# EAGLE design PLT-01-RevD (EAGLE 7.6.0)
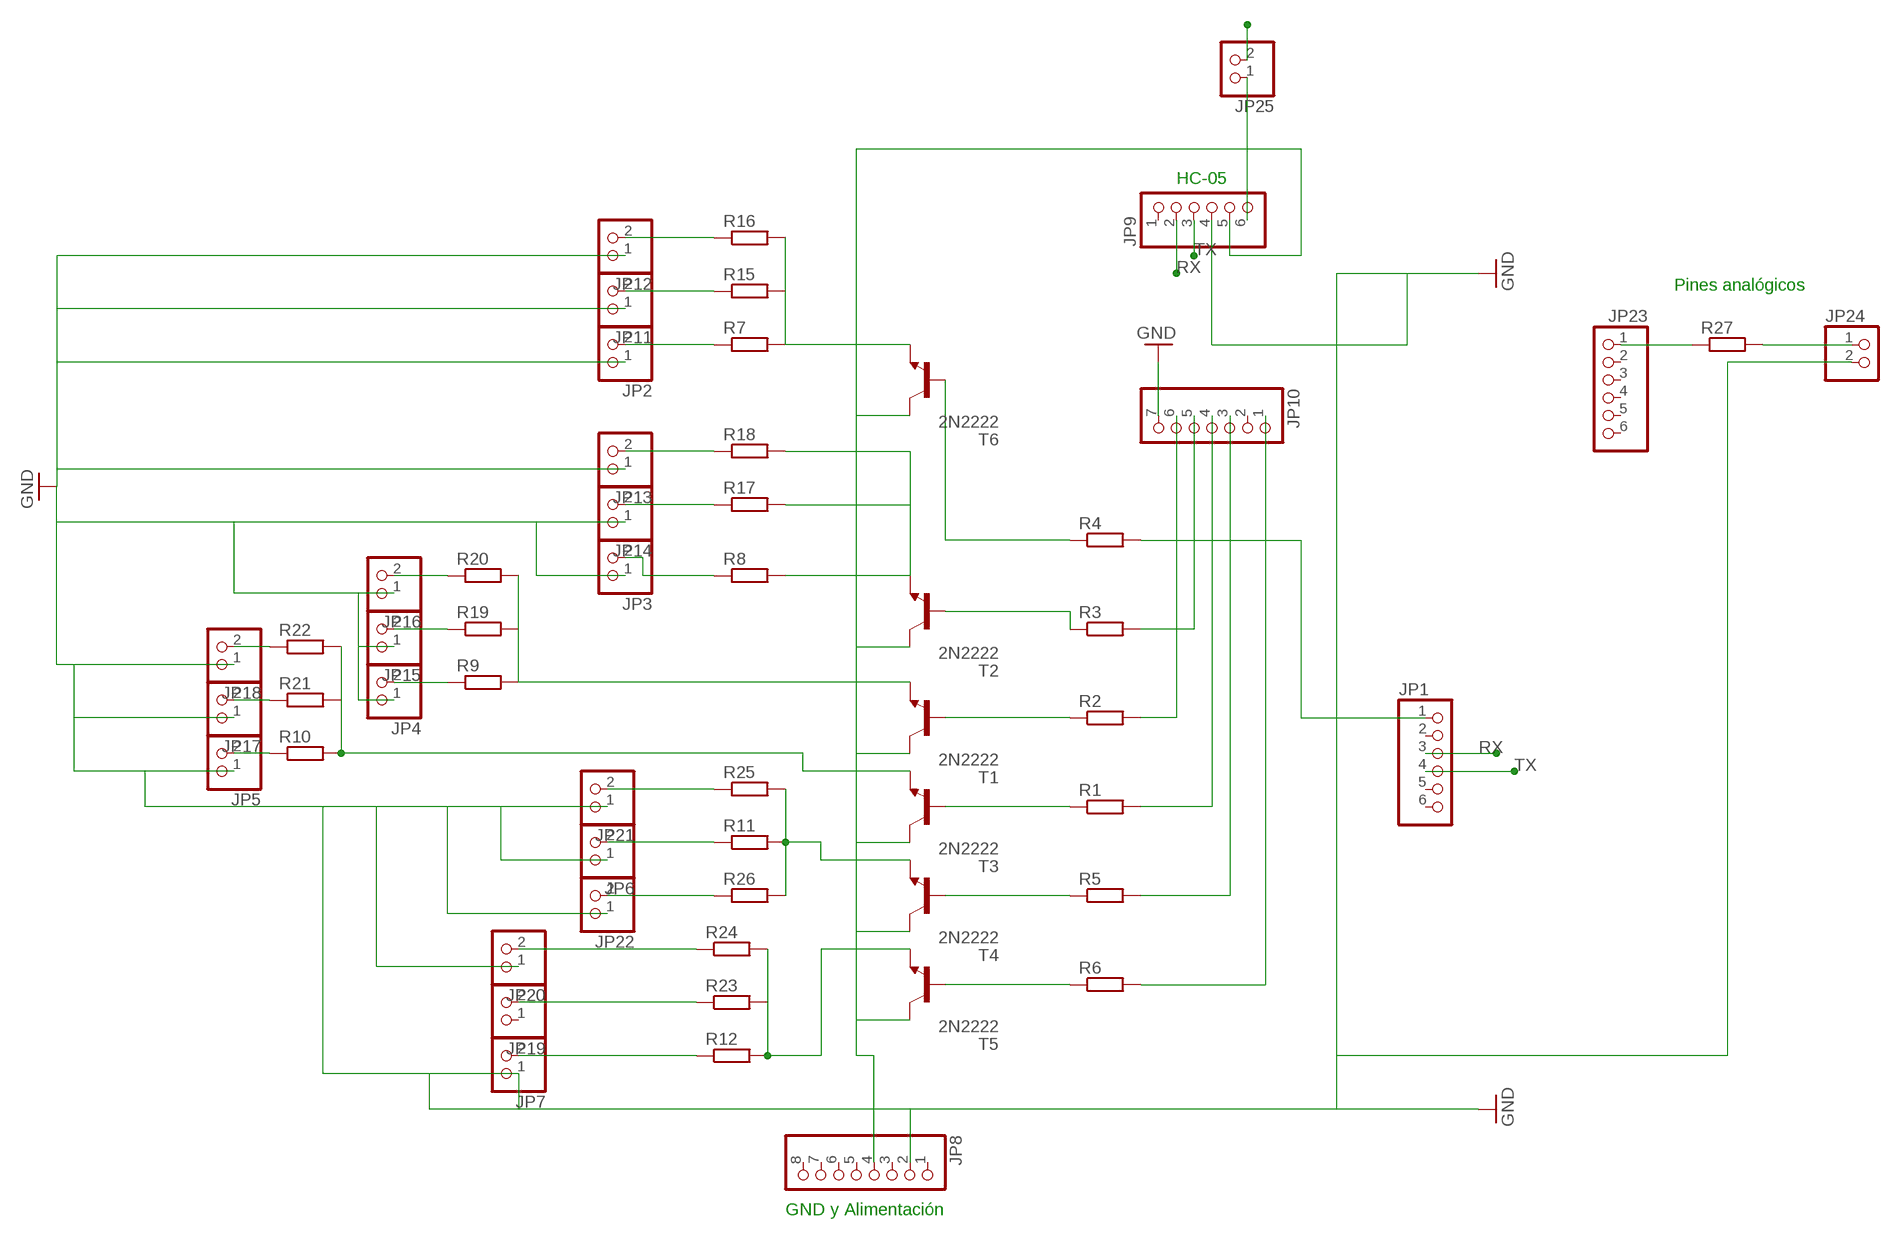
[diagram p0: schematic, sheet 1]

## Parts
JP1  PINHD-1X6  [1X06]
JP2  PINHD-1X2  [1X02]
JP3  PINHD-1X2  [1X02]
JP4  PINHD-1X2  [1X02]
JP5  PINHD-1X2  [1X02]
JP6  PINHD-1X2  [1X02]
JP7  PINHD-1X2  [1X02]
JP8  PINHD-1X8  [1X08]
JP9  PINHD-1X6  [1X06]
JP10  PINHD-1X7  [1X07]
JP11  PINHD-1X2  [1X02]
JP12  PINHD-1X2  [1X02]
JP13  PINHD-1X2  [1X02]
JP14  PINHD-1X2  [1X02]
JP15  PINHD-1X2  [1X02]
JP16  PINHD-1X2  [1X02]
JP17  PINHD-1X2  [1X02]
JP18  PINHD-1X2  [1X02]
JP19  PINHD-1X2  [1X02]
JP20  PINHD-1X2  [1X02]
JP21  PINHD-1X2  [1X02]
JP22  PINHD-1X2  [1X02]
JP23  PINHD-1X6  [1X06]
JP24  PINHD-1X2  [1X02]
JP25  PINHD-1X2  [1X02]
R1  R-EU_0207/10  [0207/10]
R2  R-EU_0207/10  [0207/10]
R3  R-EU_0207/10  [0207/10]
R4  R-EU_0207/10  [0207/10]
R5  R-EU_0207/10  [0207/10]
R6  R-EU_0207/10  [0207/10]
R7  R-EU_0207/10  [0207/10]
R8  R-EU_0207/10  [0207/10]
R9  R-EU_0207/10  [0207/10]
R10  R-EU_0207/10  [0207/10]
R11  R-EU_0207/10  [0207/10]
R12  R-EU_0207/10  [0207/10]
R15  R-EU_0207/10  [0207/10]
R16  R-EU_0207/10  [0207/10]
R17  R-EU_0207/10  [0207/10]
R18  R-EU_0207/10  [0207/10]
R19  R-EU_0207/10  [0207/10]
R20  R-EU_0207/10  [0207/10]
R21  R-EU_0207/10  [0207/10]
R22  R-EU_0207/10  [0207/10]
R23  R-EU_0207/10  [0207/10]
R24  R-EU_0207/10  [0207/10]
R25  R-EU_0207/10  [0207/10]
R26  R-EU_0207/10  [0207/10]
R27  R-EU_0207/10  [0207/10]
T1  2N2222  [TO92-EBC-OVAL]
T2  2N2222  [TO92-EBC-OVAL]
T3  2N2222  [TO92-EBC-OVAL]
T4  2N2222  [TO92-EBC-OVAL]
T5  2N2222  [TO92-EBC-OVAL]
T6  2N2222  [TO92-EBC-OVAL]

## Nets
5V: JP8.4 JP9.5 JP25.2 T1.C T2.C T3.C T4.C T5.C T6.C
GND: JP2.1 JP3.1 JP4.1 JP5.1 JP6.1 JP7.1 JP8.2 JP9.4 JP10.7 JP11.1 JP12.1 JP13.1 JP14.1 JP15.1 JP16.1 JP17.1 JP18.1 JP20.1 JP21.1 JP22.1 JP24.2
N$1: JP1.1 R4.2
N$2: JP10.5 R3.2
N$3: JP10.6 R2.2
N$4: JP10.4 R1.2
N$5: JP10.3 R5.2
N$6: JP9.6 JP25.1
N$7: R6.1 T5.B
N$8: R5.1 T4.B
N$9: R1.1 T3.B
N$10: R2.1 T1.B
N$11: R3.1 T2.B
N$12: R4.1 T6.B
N$13: R7.2 R15.2 R16.2 T6.E
N$14: JP2.2 R7.1
N$15: R8.2 R17.2 R18.2 T2.E
N$16: JP3.2 R8.1
N$17: R9.2 R19.2 R20.2 T1.E
N$18: JP4.2 R9.1
N$19: R10.2 R21.2 R22.2 T3.E
N$20: JP5.2 R10.1
N$21: R11.2 R25.2 R26.2 T4.E
N$22: JP6.2 R11.1
N$23: R12.2 R23.2 R24.2 T5.E
N$24: JP7.2 R12.1
N$29: JP13.2 R18.1
N$30: JP14.2 R17.1
N$31: JP17.2 R21.1
N$32: JP18.2 R22.1
N$33: JP19.2 R23.1
N$34: JP20.2 R24.1
N$35: JP21.2 R25.1
N$36: JP22.2 R26.1
N$37: JP12.2 R16.1
N$38: JP11.2 R15.1
N$39: JP16.2 R20.1
N$40: JP15.2 R19.1
N$41: JP23.1 R27.1
N$42: JP24.1 R27.2
N$44: JP10.1 R6.2
RX: JP1.3 JP9.2
TX: JP1.4 JP9.3
Unconnected: JP1.2 JP1.5 JP1.6 JP8.1 JP8.3 JP8.5 JP8.6 JP8.7 JP8.8 JP9.1 JP10.2 JP19.1 JP23.2 JP23.3 JP23.4 JP23.5 JP23.6

## Notes on the sheet
- HC-05
- Pines analógicos
- GND y Alimentación

## Library data of the parts
JP1 JP9 JP23 = pinhead:PINHD-1X6: PIN HEADER
JP2-JP7 JP11-JP22 JP24 JP25 = pinhead:PINHD-1X2: PIN HEADER
JP8 = pinhead:PINHD-1X8: PIN HEADER
JP10 = pinhead:PINHD-1X7: PIN HEADER
R1-R12 R15-R27 = resistor:R-EU_: RESISTOR, European symbol
T1-T6 = adafruit:2N2222: NPN TRANSISTOR Big oval pads

## Board
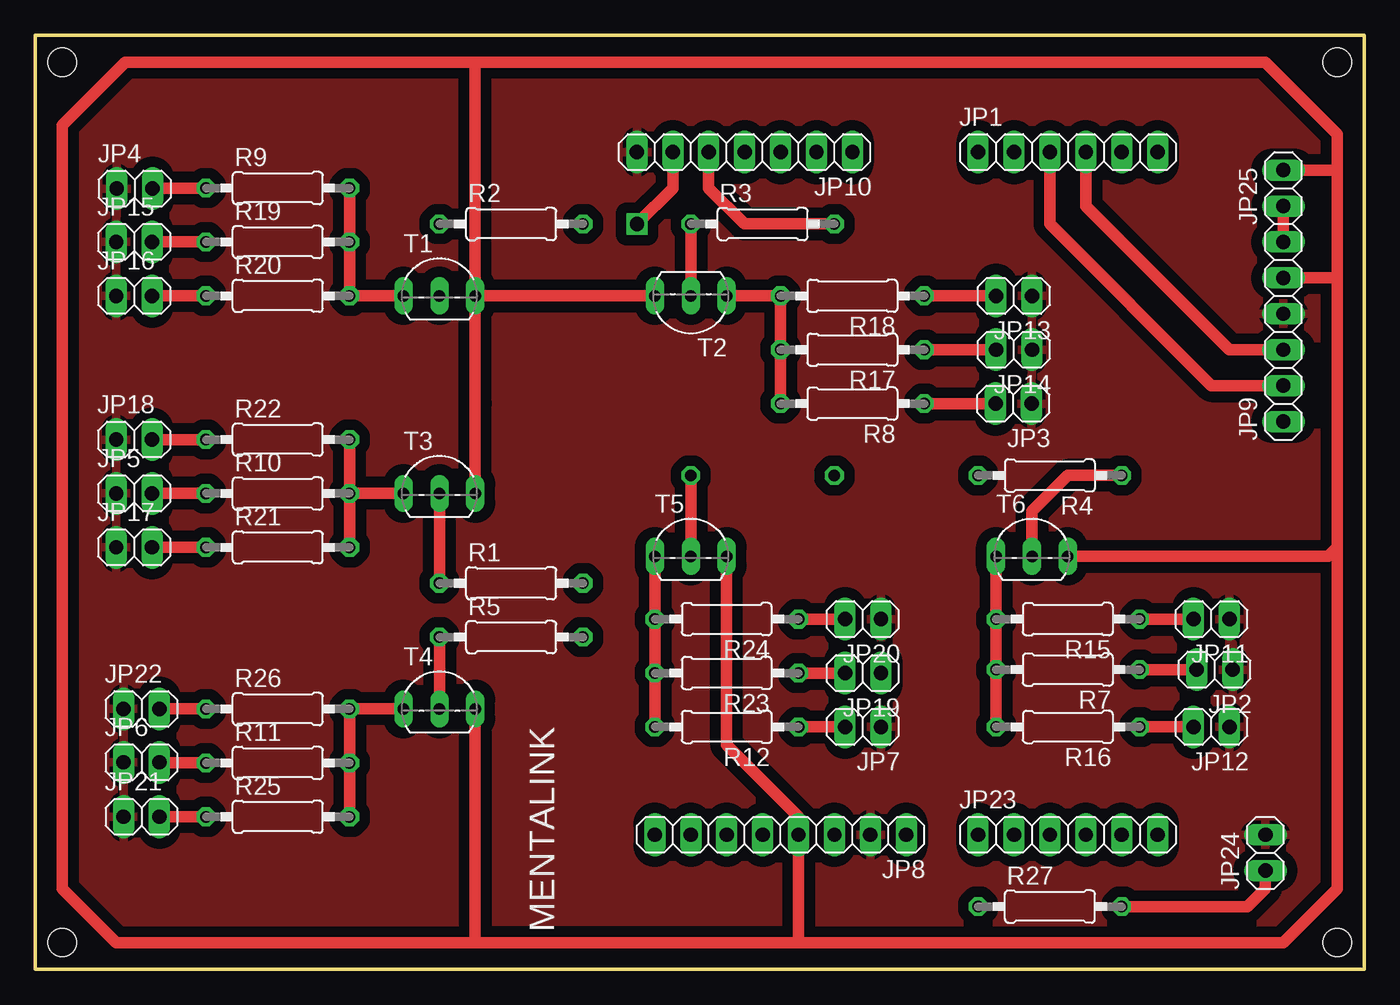
[diagram p1: board, top side]
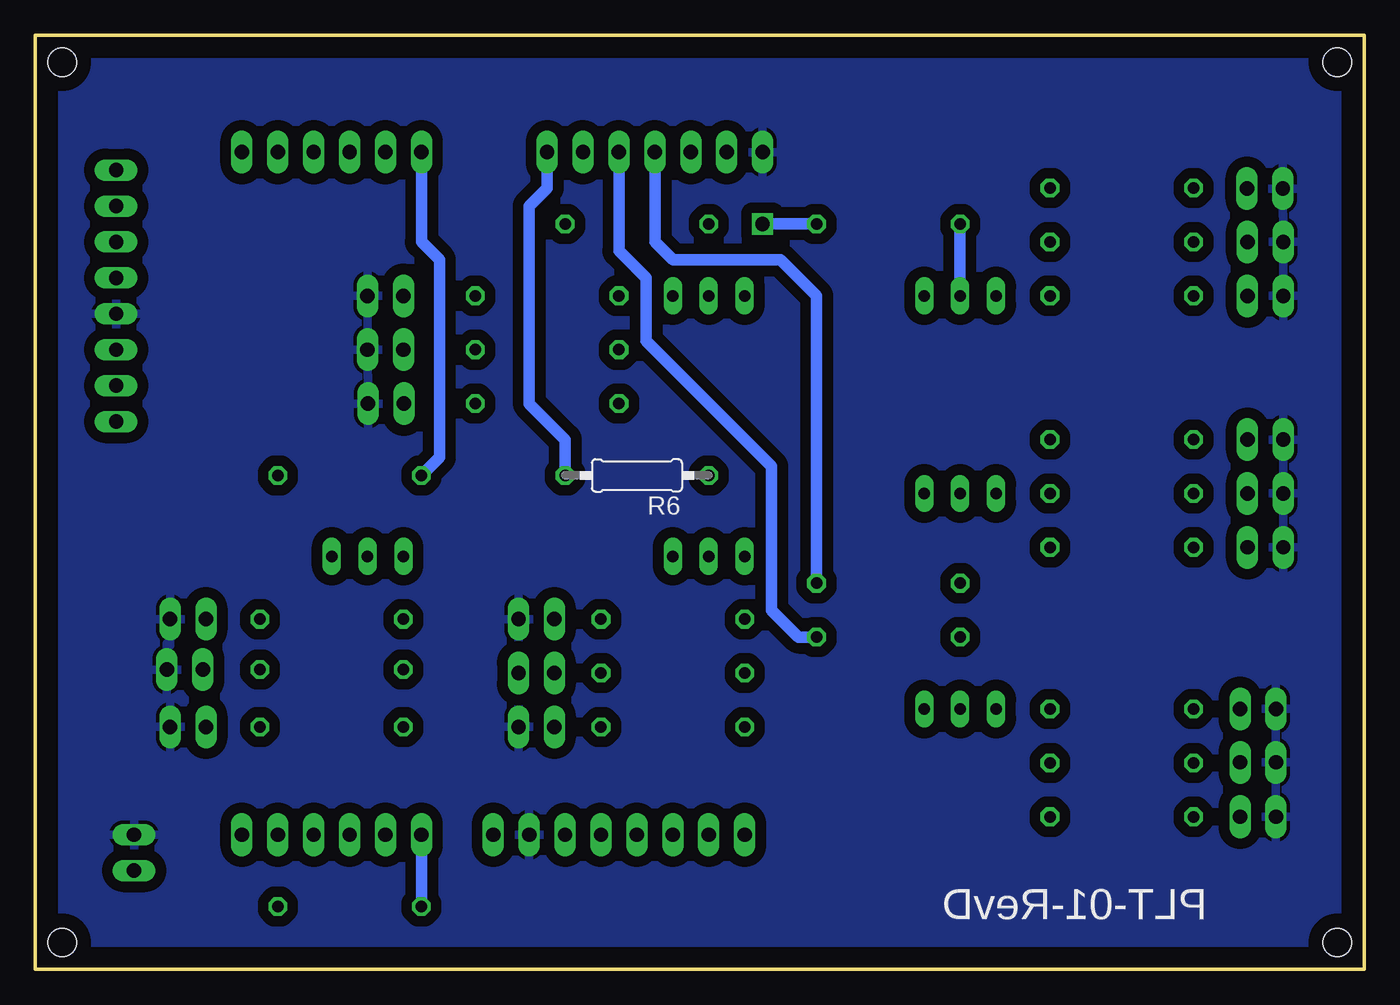
[diagram p2: board, bottom side, seen from below]

Size 93.98 x 66.04 mm. Coordinates in mm from the lower left corner, seen from the top.
Outline: 0,66.04 93.98,66.04 93.98,0 0,0 0,66.04
Copper layers (1*16): Top 0.035mm / dielectric 1.5mm / Bottom 0.035mm
Design rules "default *": minimum track width 10mil, minimum drill 24mil, track to track 30mil, track to pad 30mil, pad to pad 8mil, via to via 8mil, smd to smd 8mil, copper to edge 40mil, drill to drill 8mil, minimum pad ring 10mil, minimum via ring 8mil, stop-mask expansion 4mil, vias tented up to drill 0mil, thermal gap 10mil
Holes 2 mm at 1.91,64.14 92.08,64.14 92.08,1.91 1.91,1.91

### Footprints (pad centres in the part's own frame; a part is rotated, then mirrored left to right if it is on the bottom)
1X06 = drill 1.016 long: 1 -6.35,0; 2 -3.81,0; 3 -1.27,0; 4 1.27,0; 5 3.81,0; 6 6.35,0
1X02 = drill 1.016 long: 1 -1.27,0; 2 1.27,0
1X08 = drill 1.016 long: 1 -8.89,0; 2 -6.35,0; 3 -3.81,0; 4 -1.27,0; 5 1.27,0; 6 3.81,0; 7 6.35,0; 8 8.89,0
1X07 = drill 1.016 long: 1 -7.62,0; 2 -5.08,0; 3 -2.54,0; 4 0,0; 5 2.54,0; 6 5.08,0; 7 7.62,0
0207/10 = drill 0.813 octagon: 1 -5.08,0; 2 5.08,0
TO92-EBC-OVAL = drill 0.813 long: B 0,-1.27; C 2.54,-1.27; E -2.54,-1.27

### Placement (x,y rotation side)
JP1  73.03,57.78 0 top
JP2  83.41,21.2 180 top
JP3  69.18,40 180 top
JP4  7.02,55.2 0 top
JP5  6.98,33.66 0 top
JP6  7.5,14.64 0 top
JP7  58.53,17.15 180 top
JP8  52.7,9.53 180 top
JP9  88.27,45.09 90 top
JP10  50.16,57.78 180 top
JP11  83.19,24.77 180 top
JP12  83.19,17.15 180 top
JP13  69.22,47.62 180 top
JP14  69.22,43.81 180 top
JP15  6.98,51.43 0 top
JP16  6.98,47.62 0 top
JP17  6.98,29.85 0 top
JP18  6.98,37.46 0 top
JP19  58.53,20.96 180 top
JP20  58.53,24.77 180 top
JP21  7.5,10.79 0 top
JP22  7.5,18.42 0 top
JP23  73.03,9.53 0 top
JP24  87,8.26 90 top
JP25  88.27,55.24 90 top
R1  33.66,27.31 0 top
R2  33.66,52.7 0 top
R3  51.43,52.7 0 top
R4  71.76,34.92 180 top
R5  33.66,23.5 0 top
R6  51.43,34.92 180 bottom
R7  73.03,21.2 180 top
R8  57.78,40 180 top
R9  17.15,55.24 0 top
R10  17.15,33.66 0 top
R11  17.15,14.61 0 top
R12  48.89,17.15 180 top
R15  73.03,24.77 180 top
R16  73.03,17.15 180 top
R17  57.78,43.81 180 top
R18  57.78,47.62 180 top
R19  17.15,51.43 0 top
R20  17.15,47.62 0 top
R21  17.15,29.85 0 top
R22  17.15,37.46 0 top
R23  48.89,20.96 180 top
R24  48.89,24.77 180 top
R25  17.15,10.79 0 top
R26  17.15,18.42 0 top
R27  71.76,4.45 0 top
T1  28.58,48.89 0 top
T2  46.35,46.35 180 top
T3  28.58,34.92 0 top
T4  28.58,19.69 0 top
T5  46.35,30.48 0 top
T6  70.48,30.48 0 top

### Tracks (layer width: path | path; a pad name or v marks a point on that pad's centre or on a via)
5V
  Top 0.813: 53.98,1.91 31.12,1.91 | 53.98,1.91 JP8.4 53.98,10.79 48.89,15.88 T5.C | 31.12,40 T3.C T1.C | T1.C 31.12,64.14 | T1.C T2.C | T4.C 31.12,1.91 | 31.12,64.14 6.35,64.14 1.91,59.69 1.91,5.71 5.71,1.91 31.12,1.91 | 53.98,1.91 88.27,1.91 92.08,5.71 92.08,29.85 | 92.08,29.85 92.08,48.89 | 92.08,48.89 92.08,56.52 | 92.08,56.52 92.08,59.05 87,64.14 31.12,64.14 | T6.C 91.44,29.21 92.08,29.85 | 92.08,48.89 JP9.5 | JP25.2 92.08,56.52
GND
  pour Top: 1.91,64.14 92.08,64.14 92.08,62.86 92.08,1.91 1.91,1.91
  pour Bottom: 1.91,64.14 92.08,64.14 92.08,1.91 1.91,1.91
N$1
  Bottom 0.813: JP1.1 66.68,51.43 65.41,50.16 65.41,36.2 R4.2
N$2
  Top 0.813: JP10.5 47.62,55.24 50.16,52.7 R3.2
N$3  (via drill 1)
  Top 0.813: v42.54,52.7 45.09,55.24 JP10.6
  Bottom 0.813: R2.2 v42.54,52.7
N$4
  Bottom 0.813: JP10.4 50.16,51.43 48.89,50.16 41.27,50.16 38.73,47.62 R1.2
N$5
  Bottom 0.813: JP10.3 52.7,50.8 50.8,48.89 50.8,44.45 41.91,35.56 41.91,25.4 40,23.5 R5.2
N$6
  Top 0.813: JP25.1 JP9.6
N$7
  Top 0.813: R6.1 T5.B
N$8
  Top 0.813: R5.1 T4.B
N$9
  Top 0.813: R1.1 T3.B
N$10
  Bottom 0.813: T1.B R2.1
N$11
  Top 0.813: R3.1 T2.B
N$12
  Top 0.813: R4.1 73.03,34.92 70.48,32.38 T6.B
N$13
  Top 0.813: T6.E R15.2 R7.2 | 67.95,20.96 R7.2 | R7.2 R16.2
N$14
  Top 0.813: R7.1 JP2.2
N$15
  Top 0.813: T2.E R18.2 R17.2 R8.2
N$16
  Top 0.813: R8.1 JP3.2
N$17
  Top 0.813: R9.2 R19.2 R20.2 T1.E
N$18
  Top 0.813: R9.1 8.33,55.24 JP4.2
N$19
  Top 0.813: T3.E R10.2 | R10.2 R22.2 | R10.2 R21.2
N$20
  Top 0.813: R10.1 JP5.2
N$21
  Top 0.813: T4.E R26.2 R11.2 R25.2
N$22
  Top 0.813: R11.1 8.81,14.61 JP6.2
N$23
  Top 0.813: T5.E R24.2 R23.2 R12.2
N$24
  Top 0.813: R12.1 JP7.2
N$29
  Top 0.813: R18.1 JP13.2
N$30
  Top 0.813: R17.1 JP14.2
N$31
  Top 0.813: R21.1 JP17.2
N$32
  Top 0.813: R22.1 JP18.2
N$33
  Top 0.813: R23.1 JP19.2
N$34
  Top 0.813: R24.1 JP20.2
N$35
  Top 0.813: R25.1 JP21.2
N$36
  Top 0.813: R26.1 JP22.2
N$37
  Top 0.813: R16.1 JP12.2
N$38
  Top 0.813: R15.1 JP11.2
N$39
  Top 0.813: R20.1 JP16.2
N$40
  Top 0.813: R19.1 JP15.2
N$41
  Bottom 0.813: JP23.1 R27.1
N$42
  Top 0.813: R27.2 85.73,4.45 87,5.71 JP24.1
N$44
  Bottom 0.813: JP10.1 57.78,55.24 59.05,53.98 59.05,40 56.52,37.46 R6.2
RX
  Top 0.813: JP1.3 71.76,52.7 83.19,41.27 JP9.2
TX
  Top 0.813: JP1.4 74.3,53.98 84.45,43.81 JP9.3

### Text on the board
tNames: MENTALINK
bNames: PLT-01-RevD